# Altium schematic sheet HV Sense.SchDoc
size A4; SheetNumber: 7; SheetTotal: 11
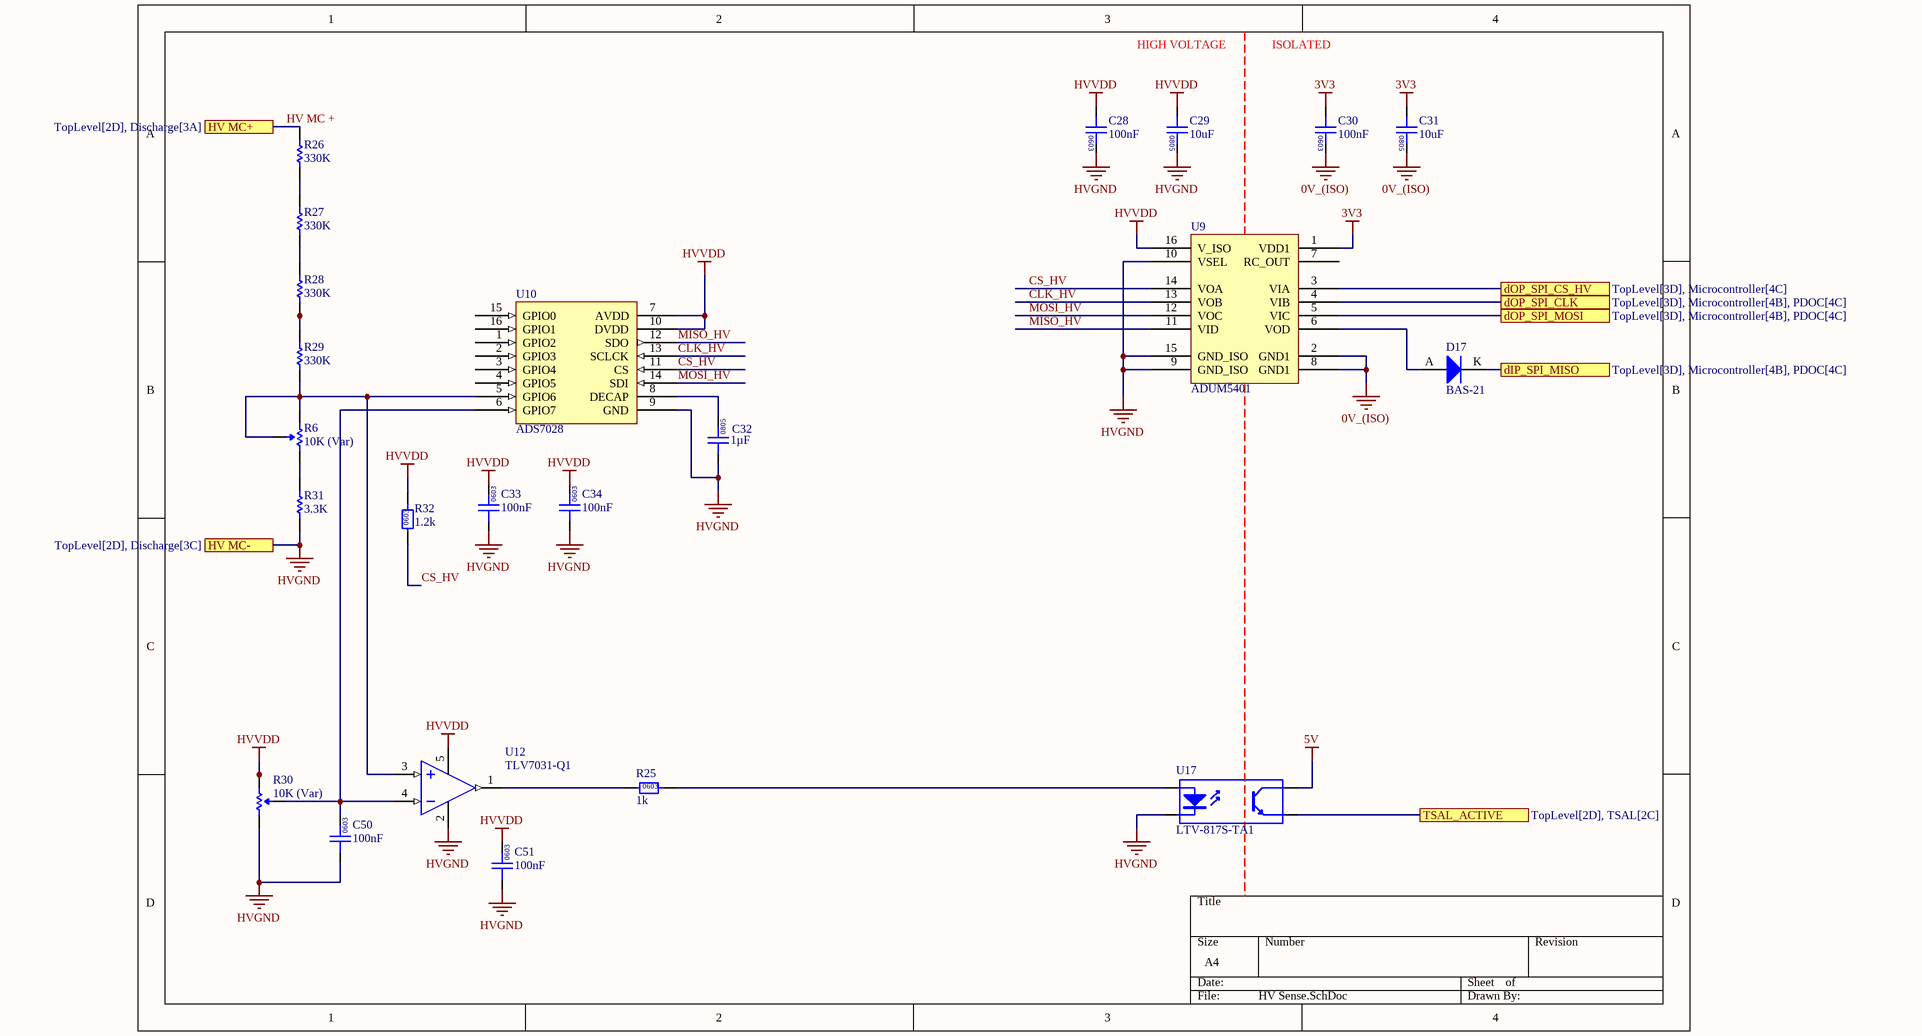
[diagram p0: HV Sense.SchDoc]

## Parts
C28  100nF  [0603]
C29  10uF  [0805]
C30  100nF  [0603]
C31  10uF  [0805]
C32  1µF  [0805]
C33  100nF  [0603]
C34  100nF  [0603]
C50  100nF  [0603]
C51  100nF  [0603]
D17  BAS-21  [NEXPERIA_SOT23]
R6  10K (Var)  [B 3296]
R25  1k  [0603]
R26  330K  [VB 0207]
R27  330K  [VB 0207]
R28  330K  [VB 0207]
R29  330K  [VB 0207]
R30  10K (Var)  [B 3296]
R31  3.3K  [VB 0207]
R32  1.2k  [0603]
U9  ADUM5401  [AD 16-SOIC]
U10  ADS7028  [WFQN-16]
U12  TLV7031-Q1  [TI SOT-23-5]
U17  LTV-817S-TA1  [ON 4-SMD]

## Ports
dIP_SPI_MISO (see TopLevel[3D], Microcontroller[4B], PDOC[4C]), dOP_SPI_CLK (see TopLevel[3D], Microcontroller[4B], PDOC[4C]), dOP_SPI_CS_HV (see TopLevel[3D], Microcontroller[4C]), dOP_SPI_MOSI (see TopLevel[3D], Microcontroller[4B], PDOC[4C]), HV MC+ (see TopLevel[2D], Discharge[3A]), HV MC- (see TopLevel[2D], Discharge[3C]), TSAL_ACTIVE (see TopLevel[2D], TSAL[2C])

## Nets
0V_(ISO): C30.2 C31.2 U9.2(GND1) U9.8(GND1)
3V3: C30.1 C31.1 U9.1(VDD1)
5V: U17.4(C)
HVGND: C28.2 C29.2 C32.1 C33.1 C34.1 C50.1 C51.1 R30.3(CW) R31.1 U9.9(GND_ISO) U9.10(VSEL) U9.15(GND_ISO) U10.9(GND) U12.2(V-) U17.2(K) ; port HV MC-
HVVDD: C28.1 C29.1 C33.2 C34.2 C51.2 R30.1(CCW) R32.2 U9.16(V_ISO) U10.7(AVDD) U10.10(DVDD) U12.5(Vcc)
CLK_HV: U9.13(VOB) U10.13(SCLCK)
CS_HV: R32.1 U9.14(VOA) U10.11(CS)
dIP_SPI_MISO: D17.K ; port dIP_SPI_MISO
dOP_SPI_CLK: U9.4(VIB) ; port dOP_SPI_CLK
dOP_SPI_CS_HV: U9.3(VIA) ; port dOP_SPI_CS_HV
dOP_SPI_MOSI: U9.5(VIC) ; port dOP_SPI_MOSI
HV MC +: R26.2 ; port HV MC+
MISO_HV: U9.11(VID) U10.12(SDO)
MOSI_HV: U9.12(VOC) U10.14(SDI)
TSAL_ACTIVE: U17.3(E) ; port TSAL_ACTIVE
NetC32_2: C32.2 U10.8(DECAP)
NetC50_2: C50.2 R30.2(Wiper) U10.6(GPIO7) U12.4(IN-)
NetD17_A: D17.A U9.6(VOD)
NetR6_1: R6.1(CCW) R31.2
NetR6_2: R6.2(Wiper) R6.3(CW) R29.1 U10.5(GPIO6) U12.3(IN+)
NetR25_1: R25.1 U12.1(OUT)
NetR25_2: R25.2 U17.1(A)
NetR26_1: R26.1 R27.2
NetR27_1: R27.1 R28.2
NetR28_1: R28.1 R29.2

Not connected (* = marked no-connect by the designer): U9 7(RC_OUT); U10 1(GPIO2) 2(GPIO3) 3(GPIO4) 4(GPIO5) 15(GPIO0) 16(GPIO1)

## Notes on the sheet
- HIGH VOLTAGE
- ISOLATED
- (in symbol GCM21BR71H105KA03L) 0805
- (in symbol GCM188L81H104KA57D) 0603
- (in symbol GRM21BR6YA106KE43L) 0805
- (in symbol RC0603FR-071KL) 0603
- (in symbol RC0603JR-071K2L) 0603

## Library data of the parts
C28 C30 C33 C34 C50 C51 = GCM188L81H104KA57D: Manufacturer: muRata; Rated Voltage: 50V; Tolerance: ±10%; Material: MLCC; Temperature Rating: X8L; Part Number: GCM188L81H104KA57D; Value: 100nF; Digikey Part Number: 490-6049-1-ND
C29 C31 = GRM21BR6YA106KE43L: Manufacturer: muRata; Rated Voltage: 50V; Tolerance: 10%; Material: MLCC; Temperature Rating: X5R; Part Number: GRM21BR6YA106KE43L; Value: 10uF; Digikey Part Number: 490-10514-6-ND
C32 = GCM21BR71H105KA03L: Manufacturer: muRata; Rated Voltage: 50V; Tolerance: ±10%; Material: MLCC; Temperature Rating: X7R; Part Number: GCM21BR71H105KA03L; Value: 1µF; Digikey Part Number: 490-10675-1-ND
D17 = BAS-21: Manufacturer: Nexperia USA Inc.; Forward Voltage: 1.0V; Breakdown Voltage: 250V; Rated Power: 250mW; Part Number: BAS-21
R6 R30 = 3296W-1-103LF: Manufacturer: Bournes Inc; Tolerance: 0.1; Rated Power: 0.5W; Part Number: 3296W-1-103LF; Value: 10K (Var); Digikey Part Number: 3296W-103LF-ND
R25 = RC0603FR-071KL: Manufacturer: YAGEO; Tolerance: 0.01; Rated Power: 0.1W; Part Number: RC0603FR-071KL; Value: 1k; Digikey Part Number: 311-1.00KHRCT-ND; Material: FR-07
R26-R29 = MMB02070C3303FB200: Manufacturer: Vishay Beyschlag; Tolerance: 0.01; Rated Power: 1W; Part Number: MMB02070C3303FB200; Value: 330K; Digikey Part Number: MMB-330KBCT-ND
R31 = MMB02070C3301FB200: Manufacturer: Vishay Beyschlag; Tolerance: 0.01; Rated Voltage: 1W; Part Number: MMB02070C3301FB200; Value: 3.3K; Digikey Part Number: MMB-3.30KBCT-ND
R32 = RC0603JR-071K2L: Manufacturer: YAGEO; Tolerance: 0.01; Rated Power: 0.1W; Part Number: RC0603JR-071K2L; Value: 1.2k; Material: FR-07; Digikey Part Number: 311-1.2KGRCT-ND
U9 = ADUM5401: Quad Channel 2.5kV Digital Isolator with isoPower; Manufacturer: Analogue Devices; Part Number: ADUM5401
U10 = ADS7028IRTER: IC ADC 12BIT SAR 16WQFN; Manufacturer: Texas Instruments; Part Number: ADS7028IRTER; Digikey Part Number: ADS7028IRTER; Digikey Link: https://www.digikey.com.au/en/products/detail/texas-instruments/ADS7028IRTER/12696020?s=N4IgTCBcDaIIIBEDKB2ADGAHASQEoBUBRXEAXQF8g
U12 = TLV7031-Q1: Manufacturer: Texas Instruments; Input Voltage: 1.6 to 6.5 V; Channels: 1; Output: Push-Pull; Part Number: TLV7031-Q1; Digikey Part Number: 296-TLV7031QDBVRQ1CT-ND
U17 = LTV-817S-TA1: 35V 50ma Optocoupler (VF=1.2V); Manufacturer: Lite-On Inc; Part Number: LTV-817S-TA1; Digikey Part Number: 160-1893-2-ND; Digikey Link: https://www.digikey.com/product-detail/en/lite-on-inc/LTV-817S-TA1/160-1893-2-ND/388451